# Altium project EDR Project.PrjPcb
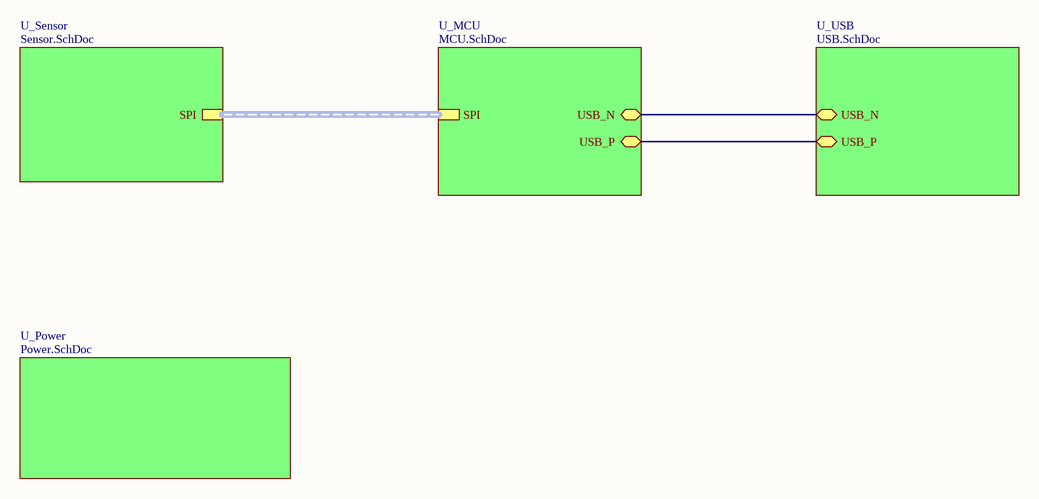
[diagram p0: Sheet2.SchDoc]
5 sheets, 58 parts. Net scope: hierarchical (ports join the sheet entries above them; power ports are global).
Board file: PCB1.PcbDoc
Sheets:
  Sheet2.SchDoc
    U_MCU = MCU.SchDoc
    U_Power = Power.SchDoc
    U_Sensor = Sensor.SchDoc
    U_USB = USB.SchDoc

## Sheet Sheet2.SchDoc
size A4; SheetNumber: 1; SheetTotal: 5

### Sub-sheets
U_MCU = MCU.SchDoc: SPI (harness SPI), USB_N (bidir), USB_P (bidir)
U_Power = Power.SchDoc: no entries
U_Sensor = Sensor.SchDoc: SPI (harness *)
U_USB = USB.SchDoc: USB_N (bidir), USB_P (bidir)

### Nets
USB_N: sheet U_MCU/USB_N, sheet U_USB/USB_N
USB_P: sheet U_MCU/USB_P, sheet U_USB/USB_P

### Buses and harness runs
harness sheet U_MCU/SPI = sheet U_Sensor/SPI

## Sheet MCU.SchDoc
size A4; SheetNumber: 2; SheetTotal: 5
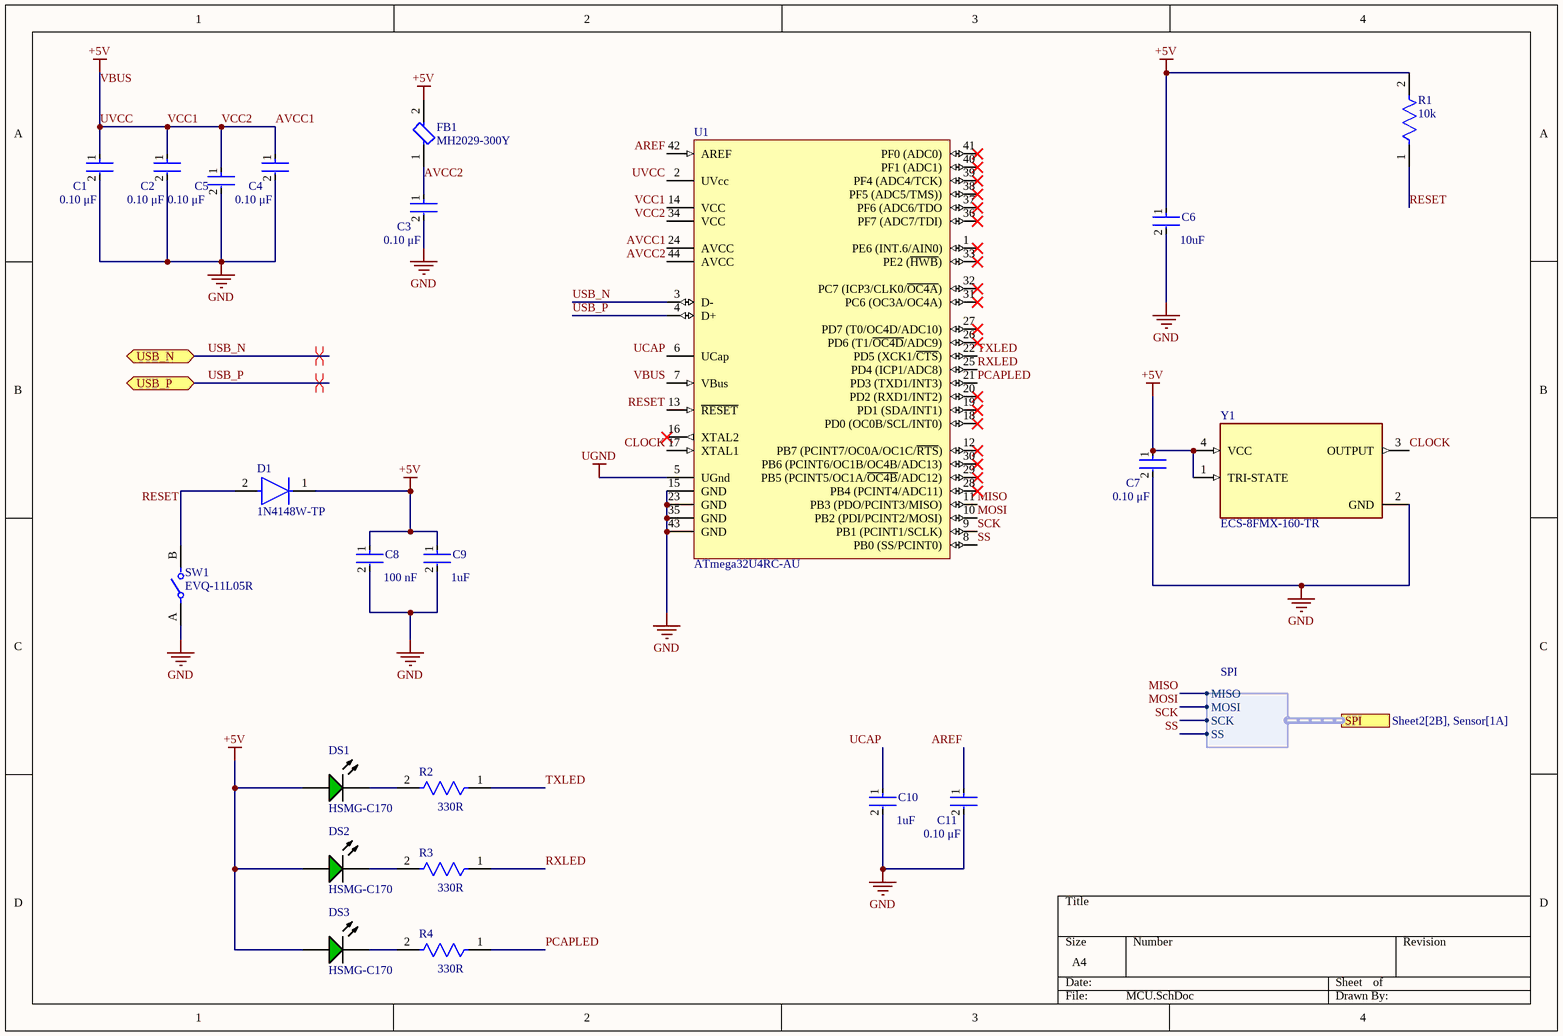
[diagram p1: MCU.SchDoc]

### Parts
C1  Capacitance: 0.10 μF  [FP-C0805C-DN-MFG]  (hidden comment: C0805C104J8RACTU)
C2  Capacitance: 0.10 μF  [FP-C0805C-DN-MFG]  (hidden comment: C0805C104J8RACTU)
C3  Capacitance: 0.10 μF  [FP-C0805C-DN-MFG]  (hidden comment: C0805C104J8RACTU)
C4  Capacitance: 0.10 μF  [FP-C0805C-DN-MFG]  (hidden comment: C0805C104J8RACTU)
C5  Capacitance: 0.10 μF  [FP-C0805C-DN-MFG]  (hidden comment: C0805C104J8RACTU)
C6  Capacitance: 10uF  [FP-C0805C-DG-MFG]  (hidden comment: C0805C106K8PACTU)
C7  Capacitance: 0.10 μF  [FP-C0805C-DN-MFG]  (hidden comment: C0805C104J8RACTU)
C8  Capacitance: 100 nF  [FP-CC0805-0_85-MFG]  (hidden comment: CC0805KRX7R7BB104)
C9  Capacitance: 1uF  [FP-C0805C-DG-MFG]  (hidden comment: C0805C106K8PACTU)
C10  Capacitance: 1uF  [FP-C0805C-DG-MFG]  (hidden comment: C0805C106K8PACTU)
C11  Capacitance: 0.10 μF  [FP-C0805C-DN-MFG]  (hidden comment: C0805C104J8RACTU)
D1  1N4148W-TP  [FP-SOD-123-IPC_A]
DS1  HSMG-C170  [AVAG-HSMX-C170_V]
DS2  HSMG-C170  [AVAG-HSMX-C170_V]
DS3  HSMG-C170  [AVAG-HSMX-C170_V]
FB1  MH2029-300Y  [FP-MH2029-MFG]
R1  Resistance: 10k  [FP-CRCW0805-e3-IPC_C]  (hidden comment: CRCW080522R0FKEA)
R2  Resistance: 330R  [FP-CR0805-IPC_B]  (hidden comment: 330 R)
R3  Resistance: 330R  [FP-CR0805-IPC_B]  (hidden comment: 330 R)
R4  Resistance: 330R  [FP-CR0805-IPC_B]  (hidden comment: 330 R)
SW1  EVQ-11L05R  [FP-EVQ-11L05R-MFG]
U1  ATmega32U4RC-AU  [44ML_N]
Y1  ECS-8FMX-160-TR  [OSC_ECS-8FMX-160-TR]

### Ports
SPI (harness SPI, see Sheet2[2B], Sensor[1A]), USB_N (bidir, see Sheet2[3B], USB[3B]), USB_P (bidir, see Sheet2[3B], USB[3B])

### Harnesses
SPI: MISO, MOSI, SCK, SS

### Nets
AVCC1: C1.1 C2.1 C4.1 C5.1 C6.1 C7.1 C8.1 C9.1 D1.1(C) DS1.1(A) DS2.1(A) DS3.1(A) FB1.2 R1.2 U1.2(UVcc) U1.7(VBus) U1.14(VCC) U1.24(AVCC) U1.34(VCC) Y1.1(TRI-STATE) Y1.4(VCC)  [also labelled +5V, UVCC, VBUS, VCC1, VCC2]
GND: C1.2 C2.2 C3.2 C4.2 C5.2 C6.2 C7.2 C8.2 C9.2 C10.2 C11.2 SW1.A U1.15(GND) U1.23(GND) U1.35(GND) U1.43(GND) Y1.2(GND)
UGND: U1.5(UGnd)
AREF: C11.1 U1.42(AREF)
AVCC2: C3.1 FB1.1 U1.44(AVCC)
CLOCK: U1.17(XTAL1) Y1.3(OUTPUT)
MISO: U1.11(PB3_(PDO/PCINT3/MISO)) ; port SPI.MISO
MOSI: U1.10(PB2_(PDI/PCINT2/MOSI)) ; port SPI.MOSI
PCAPLED: R4.1 U1.21(PD3_(TXD1/INT3))
RESET: D1.2(A) R1.1 SW1.B U1.13(~{RESET})
RXLED: R3.1 U1.25(PD4_(ICP1/ADC8))
SCK: U1.9(PB1_(PCINT1/SCLK)) ; port SPI.SCK
SS: U1.8(PB0_(SS/PCINT0)) ; port SPI.SS
TXLED: R2.1 U1.22(PD5_(XCK1/~{CTS}))
UCAP: C10.1 U1.6(UCap)
USB_N: U1.3(D-) ; port USB_N
USB_P: U1.4(D+) ; port USB_P
NetDS1_2: DS1.2(K) R2.2
NetDS2_2: DS2.2(K) R3.2
NetDS3_2: DS3.2(K) R4.2

Not connected (* = marked no-connect by the designer): U1 1(PE6_(INT.6/AIN0))* 12(PB7_(PCINT7/OC0A/OC1C/~{RTS}))* 16(XTAL2)* 18(PD0_(OC0B/SCL/INT0))* 19(PD1_(SDA/INT1))* 20(PD2_(RXD1/INT2))* 26(PD6_(T1/~{OC4D}/ADC9))* 27(PD7_(T0/OC4D/ADC10))* 28(PB4_(PCINT4/ADC11))* 29(PB5_(PCINT5/OC1A/~{OC4B}/ADC12))* 30(PB6_(PCINT6/OC1B/OC4B/ADC13))* 31(PC6_(OC3A/OC4A))* 32(PC7_(ICP3/CLK0/~{OC4A}))* 33(PE2_(~{HWB}))* 36(PF7_(ADC7/TDI))* 37(PF6_(ADC6/TDO)* 38(PF5_(ADC5/TMS)))* 39(PF4_(ADC4/TCK))* 40(PF1_(ADC1))* 41(PF0_(ADC0))*

### Layout directives
differential pair: USB_N, USB_P

### Library data of the parts
C1-C5 C7 C11 = CMP-03020-032188-1: CAP CER 0.1UF 10V 5% X7R 0805; Manufacturer: KEMET; Material: Ceramic; Tolerance: 0.05; Temperature Coefficient: 30ppm/°C; Value: 0.10 μF; Package: C0805C-DN; Device Class L1: Passive Components; Temperature: -55°C to +125°C; Category: Cap; RoHS: TRUE; Mouser Description: Multilayer Ceramic Capacitors MLCC - SMD/SMT 10volts 0.1uF X7R 5%; Lead Free: Yes; Temperature Range Low: -55°C; Temperature Range High: +125°C; Device Class L2: Capacitors; Temperature Characteristic: X7R; Device Class L3: Ceramic Capacitors; ComponentLink2Description: Datasheet; Automotive: No; Ipc Land Pattern Name: CAPC200125X78; Manufacturer Part Number: C0805C104J8RACTU; Voltage Rating: 10 V; Height: 0.88mm; Digikey Description: CAP CER 0.1UF 10V 5% X7R 0805; Octopart: https://octopart.com/c0805c104j8ractu-kemet-11807087; ComponentLink2URL: https://content.kemet.com/datasheets/KEM_C1003_C0G_SMD.pdf
C6 C9 C10 = CMP-2007-03243-2: CAP CER 10UF 10V X5R 0805; Manufacturer: Kemet; 3DS Part Number: 220-00001; Tolerance: 10%; Temperature Coefficient: 15%; Material: Ceramic; Device Class L2: Capacitors; Device Class L1: Passive Components; ComponentLink2URL: https://content.kemet.com/datasheets/KEM_C1006_X5R_SMD.pdf; Height: 1.4mm; Lead Free: Yes; Manufacturer Part Number: C0805C106K8PACTU; Digikey Description: CAP CER 10UF 10V X5R 0805; Octopart: https://octopart.com/c0805c106k8pactu-kemet-98697; Value: 10uF; Temperature Range Low: -55°C; Temperature: -55°C to +85°C; Automotive: No; Mouser Description: CAP CER 10UF 10V X5R 0805; Ipc Land Pattern Name: CAPC200125X125; Temperature Range High: +85°C; Voltage: 10V; RoHS: TRUE; Device Class L3: Ceramic Capacitors; ComponentLink2Description: Datasheet; Voltage Rating: 10V; Package: C0805C-DG; Temperature Characteristic: X5R; Category: Cap
C8 = CMP-1036-04402-6: CAP CER 0.1UF 16V X7R 0805; Manufacturer: Yageo; Material: Ceramic; Tolerance: 0.1; Value: 100 nF; Manufacturer Part Number: CC0805KRX7R7BB104; Temperature: -30°C to +85°C; Lead Free: Yes; Footprint Url: http://www.yageo.com/exep/pages/download/literatures/UPY-C_GEN_24.pdf; Voltage Rating: 16 V; Package: CC0805-0.85; RoHS: TRUE; Digikey Description: CAP CER 0.1UF 16V X7R 0805; Category: Cap; Octopart: https://octopart.com/cc0805krx7r7bb104-yageo-39467769; Device Class L3: Ceramic Capacitors; ComponentLink2URL: http://www.yageo.com/documents/recent/UPY-GPHC_Y5V_6.3V-to-50V_8.pdf; Temperature Range Low: -30°C; Mouser Description: Multilayer Ceramic Capacitors MLCC - SMD/SMT 100nF 16V X7R 10%; Automotive: No; Device Class L2: Capacitors; Height: 0.95mm; ComponentLink2Description: Datasheet; Temperature Characteristic: X7R; Ipc Land Pattern Name: CAPC200125X85; Device Class L1: Passive Components; Temperature Range High: +85°C
D1 = CMP-2000-04993-2: DIODE GEN PURP 100V 150MA SOD123; Max Reverse Leakage Current: 5uA; Max Surge Current: 2A; Reverse Recovery Time: 4ns; Polarity: Standard; Capacitance: 4pF; Max Forward Surge Current (Ifsm): 1A; Element Configuration: Single; Power Dissipation: 400mW; Forward Voltage: 1V; Radiation Hardening: No; Lead Free: Lead Free; Max Reverse Voltage (DC): 100V; Current Rating: 150mA; Forward Current: 150mA; Packaging: Tape and Reel; Number of Pins: 2; Package Quantity: 3000; Max Operating Temperature: 150°C; Min Operating Temperature: -65°C; Average Rectified Current: 150mA; Recovery Time: 4ns; Output Current: 150mA; Peak Non-Repetitive Surge Current: 2A; Width: 1.8mm; Voltage Rating (DC): 100V; Height: 1.2mm; Max Repetitive Reverse Voltage (Vrrm): 100V; Mount: Surface Mount; Length: 2.85mm
DS1-DS3 = CMP-2000-05062-1: Chip LED, Green, 2.2 V, -40 to 85 degC, 2-Pin SMD, Pb-Free, Tape and Reel; Manufacturer: Avago; No. of Pins: 2; Peak Wavelength: 570nm; SVHC: NoSVHC(16-Jun-2014); Dominant Wavelength: 572nm; Forward Current If: 20mA; Viewing Angle: 170deg; Lens Shape: Rectangular; PIV Max: 5V; External Width: 1.25mm; LED Type: Standard; External Depth: 0.8mm; Opto Mounting Orientation: Top; Luminous Intensity: 15mcd; Luminous Intensity Min: 4mcd; Forward Voltage VF Max: 2.6V; External Length / Height: 2mm; Bulb Size: 1.25mmx1.4mm; Light Area Height: 1mm; Voltage Vf Typ: 2.2V; Operating Temperature Max: 85degC; Datasheet Version: Oct-08; MSL: MSL2A-4weeks; Peak Forward Current: 20mA; Package Description: 2-Pin Surface Mount Device, Body 2 x 1.25 mm, Height 0.8 mm; Datasheet URL: https://datasheet.ciiva.com/29280/180495-da-01-en-chip-led-hsmg-c170-gelb-gruen-29280971.pdf; Storage Temperature Min: -40degC; LED Colour: Green; Wavelength Typ: 570nm; Mounting Type: SMD; Forward Current If Max: 20mA; Dominant Wavelength Typ: 572nm; LED Mounting: SMD; Operating Temperature Range: -30degCto+85degC; Operating Temperature Min: -30degC; Manufacturer URL: http://www.avagotech.com/; Packaging: CutTape; Luminous Intensity Typ: 15mcd; Package Reference: HSMX-C170; Storage Temperature Max: 85degC; Opto Case Style: SMD; Forward Voltage: 2.2V
FB1 = CMP-07252-000001-1: FERRITE BEAD 30 OHM 0805 1LN; Manufacturer: Bourns; Series Resistance: 25mΩ; Description: MH Series High Current Chip Ferrite Beads; Resistance: 30Ω; Value: 30Ω; Impedance At Frequency: 30Ω @ 100MHz; Rms Current: 3A; Tolerance: 25%; RoHS: TRUE; Manufacturer Part Number: MH2029-300Y; Temperature Range High: +125°C; Device Class L3: Ferrite Beads and Chips; Core Material: Ferrite; ComponentLink2Description: Datasheet; Category: FBead; Octopart: https://octopart.com/mh2029-300y-bourns-756929; Digikey Description: FERRITE BEAD 30 OHM 0805 1LN; Device Class L2: EMI / RFI Components; Lead Free: Yes; Mouser Description: Ferrite Beads 30 ohms 25% HIGH CURRENT; Automotive: No; Ipc Land Pattern Name: CAPC200120X90; Temperature: -55°C to +125°C; Device Class L1: Passive Components; Height: 1.1mm; ComponentLink2URL: https://www.bourns.com/docs/Product-Datasheets/mh.pdf; Package: MH2029; Temperature Range Low: -55°C
R1 = CMP-2001-03692-2: RES Thick Film, 22Ω, 1%, 0.125W, 100ppm/°C, 0805; Power Rating: 125mW; Voltage Rating: 150V; Case/Package: 0805; Radiation Hardening: No; Number of Terminations: 2; Termination: SMD/SMT; Package Quantity: 5000; Weight: 0.000194oz; Mount: Surface Mount; Lead Free: Lead Free; Height: 0.45mm; Composition: Thick Film; Min Operating Temperature: -55°C; Case Code (Metric): 2012; Temperature Coefficient: 100ppm/°C; Depth: 1.25mm; Packaging: Tape and Reel; Contact Plating: Tin; Width: 1.25mm; Case Code (Imperial): 0805; Length: 2mm; Max Operating Temperature: 155°C; Tolerance: 1%; Features: Automotive AEC-Q200; Military Standard: Not; Voltage Rating (DC): 150V; Max Power Dissipation: 125mW
R2-R4 = CMP-1013-00454-2: Thick Film Chip Resistors 0805 330Ω 0.125W 1% 100ppm/°C; Voltage Rating: 150V; Power Rating: 125mW; Case Code (Imperial): 0805; Packaging: Tape and Reel; REACH SVHC: No SVHC; Min Operating Temperature: -55°C; Height: 0.5mm; Tolerance: 1%; Radiation Hardening: No; Depth: 1.25mm; Mount: Surface Mount; Length: 2mm; Voltage Rating (DC): 150V; Contact Plating: Tin; Temperature Coefficient: 100ppm/°C; Thickness: 508um; Max Operating Temperature: 155°C; Termination: SMD/SMT; Military Standard: Not; Case Code (Metric): 2012; Width: 1.25mm; Package Quantity: 5000; Case/Package: 0805; Composition: Thick Film
SW1 = CMP-00287-55640044-1: EVQ-11L05R Switch Tactile N.O. SPST Round Button PC Pins 0.02A 15VDC 1.6N Thru-Hole Radial T/R; Max Current Rating: 20mA; Max Voltage Rating (DC): 15V; Mechanical Life: 100kcycles; Switch Function: Off-Mom; Switch Travel: 250µm; Number of Positions: 2; Actuator Length: 1.1mm; Illumination Type: Illuminated, Non-Illuminated; Contact Resistance: 50mΩ; Orientation: Straight; Max Operating Temperature: 70°C; Voltage Rating (DC): 15V; Length: 6mm; Electrical Life: 100kcycles; NexarPartId: 55640044; Termination: PC Pin; Height: 5mm; Radiation Hardening: No; Lead Free: Lead Free; Current Rating: 20mA; Mount: Through Hole; RoHS: Compliant; Operating Force: 1.6N; Contact Current Rating: 20mA; Throw Configuration: SPST; Life (Cycles): 100kcycles; REACH SVHC: Unknown; Min Operating Temperature: -20°C; Depth: 6mm; Case/Package: Radial
U1 = CMP-0095-00580-1: 8-bit AVR Microcontroller, 2.7-5.5V, 16MHz, 32KB Flash, 1KB EEPROM, 2.5KB SRAM, USB Controller, 44-pin TQFP, Industrial Grade (-40°C to 85°C), Int RC; PackageVersion: rev.G, Jul-2007; ComponentLink1URL: http://www.atmel.com/; ComponentLink2URL: http://www.atmel.com/dyn/resources/prod_documents/doc7766.pdf; PackageReference: 44ML; ComponentLink2Description: ATmega16U4/32U4 Datasheet; PackageDescription: 44-Pin Plastic Thin Quad Flat Pack, 10 x 10 x 1.0 mm Body, 0.8 mm Pitch (TQFP); ComponentLink3URL: http://www.atmel.com/dyn/resources/prod_documents/7766S.pdf; ComponentLink1Description: Manufacturer URL; DatasheetVersion: revF, Nov-2010; ComponentLink3Description: ATmega16U4 ATmega32U4 Summary
Y1 = CMP-009-000000-1: CMOS Oscillator Enable/Disable 4-SOJ, 5.08mm pitch; Component Type: Standard; Availability: Unavailable; Pin Count: 4; Price: None; Source: ECS-8FMX-160-TR.SchLib; Design Item ID: ECS-8FMX-160-TR; Value: *; MP: ECS-8FMX-160-TR; Package: None

## Sheet Power.SchDoc
size A4; SheetNumber: 4; SheetTotal: 5
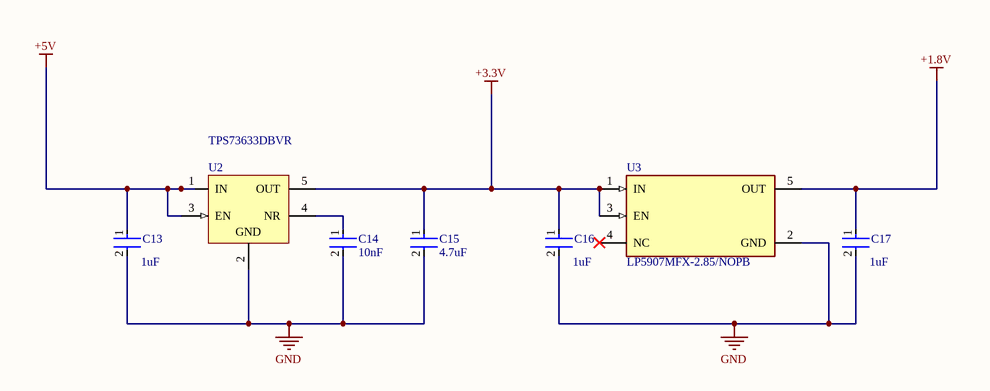
[diagram p2: Power.SchDoc]

### Parts
C13  Capacitance: 1uF  [FP-C0805C-DG-MFG]  (hidden comment: C0805C106K8PACTU)
C14  10nF  [FP-C0805C-DN-MFG]
C15  4.7uF  [FP-C0805C475K8PACTU-MFG]
C16  Capacitance: 1uF  [FP-C0805C-DG-MFG]  (hidden comment: C0805C106K8PACTU)
C17  Capacitance: 1uF  [FP-C0805C-DG-MFG]  (hidden comment: C0805C106K8PACTU)
U2  TPS73633DBVR  [DBV0005A_L]
U3  LP5907MFX-2.85/NOPB  [FP-DBV0005A-IPC_C]

### Nets
+1.8V: C17.1 U3.5(OUT)
+3.3V: C15.1 C16.1 U2.5(OUT) U3.1(IN) U3.3(EN)
+5V: C13.1 U2.1(IN) U2.3(EN)  [project net AVCC1]
GND: C13.2 C14.2 C15.2 C16.2 C17.2 U2.2(GND) U3.2(GND)
NetC14_1: C14.1 U2.4(NR)

Not connected (* = marked no-connect by the designer): U3 4(NC)*

### Library data of the parts
C13 C16 C17 = CMP-2007-03243-2: as C6 on sheet MCU; Device Class L2: Capacitors; Device Class L1: Passive Components; ComponentLink2URL: https://content.kemet.com/datasheets/KEM_C1006_X5R_SMD.pdf; Height: 1.4mm; Lead Free: Yes; Manufacturer Part Number: C0805C106K8PACTU; Digikey Description: CAP CER 10UF 10V X5R 0805; Octopart: https://octopart.com/c0805c106k8pactu-kemet-98697; Value: 10uF; Temperature Range Low: -55°C; Temperature: -55°C to +85°C; Automotive: No; Mouser Description: CAP CER 10UF 10V X5R 0805; Ipc Land Pattern Name: CAPC200125X125; Temperature Range High: +85°C; Voltage: 10V; RoHS: TRUE; Device Class L3: Ceramic Capacitors; ComponentLink2Description: Datasheet; Voltage Rating: 10V; Package: C0805C-DG; Temperature Characteristic: X5R; Category: Cap
C14 = CMP-2007-00493-2: CAP CER 10000PF 25V 5% NP0 0805; Manufacturer: KEMET; Manufacturer Part Number: C0805C103J3GACTU; Capacitance: 10,000 pF; Tolerance: 0.05; Value: 10,000 pF; Material: Ceramic; Temperature Characteristic: C0G; Temperature Coefficient: 30ppm/°C; Octopart: https://octopart.com/c0805c103j3gactu-kemet-12563663; Lead Free: Yes; RoHS: TRUE; Package: C0805C-DN; Voltage Rating: 25 V; Ipc Land Pattern Name: CAPC200125X78; ComponentLink2URL: https://content.kemet.com/datasheets/KEM_C1003_C0G_SMD.pdf; Device Class L1: Passive Components; Category: Cap; ComponentLink2Description: Datasheet; Temperature Range High: +125°C; Height: 0.88mm; Temperature Range Low: -55°C; Device Class L3: Ceramic Capacitors; Digikey Description: CAP CER 10000PF 25V 5% NP0 0805; Device Class L2: Capacitors; Mouser Description: Multilayer Ceramic Capacitors MLCC - SMD/SMT 25volts 10000pF 5% C0G; Temperature: -55°C to +125°C; Automotive: No
C15 = CMP-2007-01007-2: CAP CER 4.7UF 10V X5R 0805; Dielectric Material: Ceramic; Dissipation Factor: 5%; Tolerance: 10%; Lead Pitch: 0.75mm; Mount: Surface Mount; Voltage Rating (DC): 10V; Length: 2mm; Case Code (Imperial): 0805; Height: 1.25mm; Package Quantity: 1; Thickness: 0.055inch; Depth: 1.25mm; Case Code (Metric): 2012; Termination: SMD/SMT; Construction: Flat; Dielectric: X5R; Series: C; Capacitance: 4.7uF; Width: 1.2mm; Max Operating Temperature: 85°C; Packaging: Tape and Reel; Voltage Rating: 10V; REACH SVHC: No SVHC; Min Operating Temperature: -55°C; Number of Pins: 2; Case/Package: 0805; Radiation Hardening: No; Lead Free: Lead Free; Voltage: 10V; RoHS Compliant: Yes
U2 = CMP-0395-00256-2: Single Output Low Noise LDO, 400 mA, Fixed 3.3 V Output, 1.7 to 5.5 V Input, with Reverse Current Protection, 5-pin SOT-23 (DBV), -40 to 85 degC, Green (RoHS & no Sb/Br); Manufacturer: Texas Instruments; Vin(Min)(V): 1.7; Vdo(Typ)(mV): 75; Iq(Typ)(mA): 0.3; SubFamily: Single Channel LDO; Vout Adj(Max)(V): 3.3; Accuracy(%): 1; Vin(Max)(V): 5.5; Iout(Max)(A): 0.4; Rating: Catalog; ComponentLink1Description: Manufacturer URL; PartNumber: TPS73633DBVR; PackageDescription: 5-Pin Plastic Small Outline, Body 1.60 Ãƒâ€” 2.90 mm, Pitch 0.95 mm; ComponentLink3URL: http://www.ti.com/litv/pdf/mpds018i; ComponentLink2Description: Datasheet; ComponentLink4Description: URL Link1; DatasheetVersion: SBVS038T; Vout Adj(Min)(V): 3.3; Code_JEDEC: MO-178; Fixed Output Options(V): 3.3; Eco-Plan: Green (RoHS & no Sb/Br); PackageReference: DBV0005A; ComponentLink4URL: Samples URL:http://www.ti.com/product/tps73633#samples; PackageVersion: 4073253-4/K; ComponentLink2URL: http://www.ti.com/general/docs/lit/getliterature.tsp?genericPartNumber=TPS73633&fileType=pdf; ComponentLink1URL: http://www.ti.com/; ComponentLink3Description: Package Specification; Mounting Technology: Surface Mount
U3 = CMP-04917-000259-2: IC REG LIN 2.85V 250MA SOT23-5; Number of Outputs: 1; Min Input Voltage: 2.2V; Output Type: Fixed; Power Supply Rejection Ratio (PSRR): 82dB; Max Input Voltage: 5.5V; Quiescent Current: 12uA; Dropout Voltage: 250mV; Output Current: 250mA; Packaging: Tape and Reel; Max Operating Temperature: 125°C; Min Operating Temperature: -40°C; RoHS Compliant: Yes; Package Quantity: 3000; Lead Free: Lead Free; Output Voltage: 2.85V; Case/Package: SOT-23-5

## Sheet Sensor.SchDoc
size A4; SheetNumber: 5; SheetTotal: 5
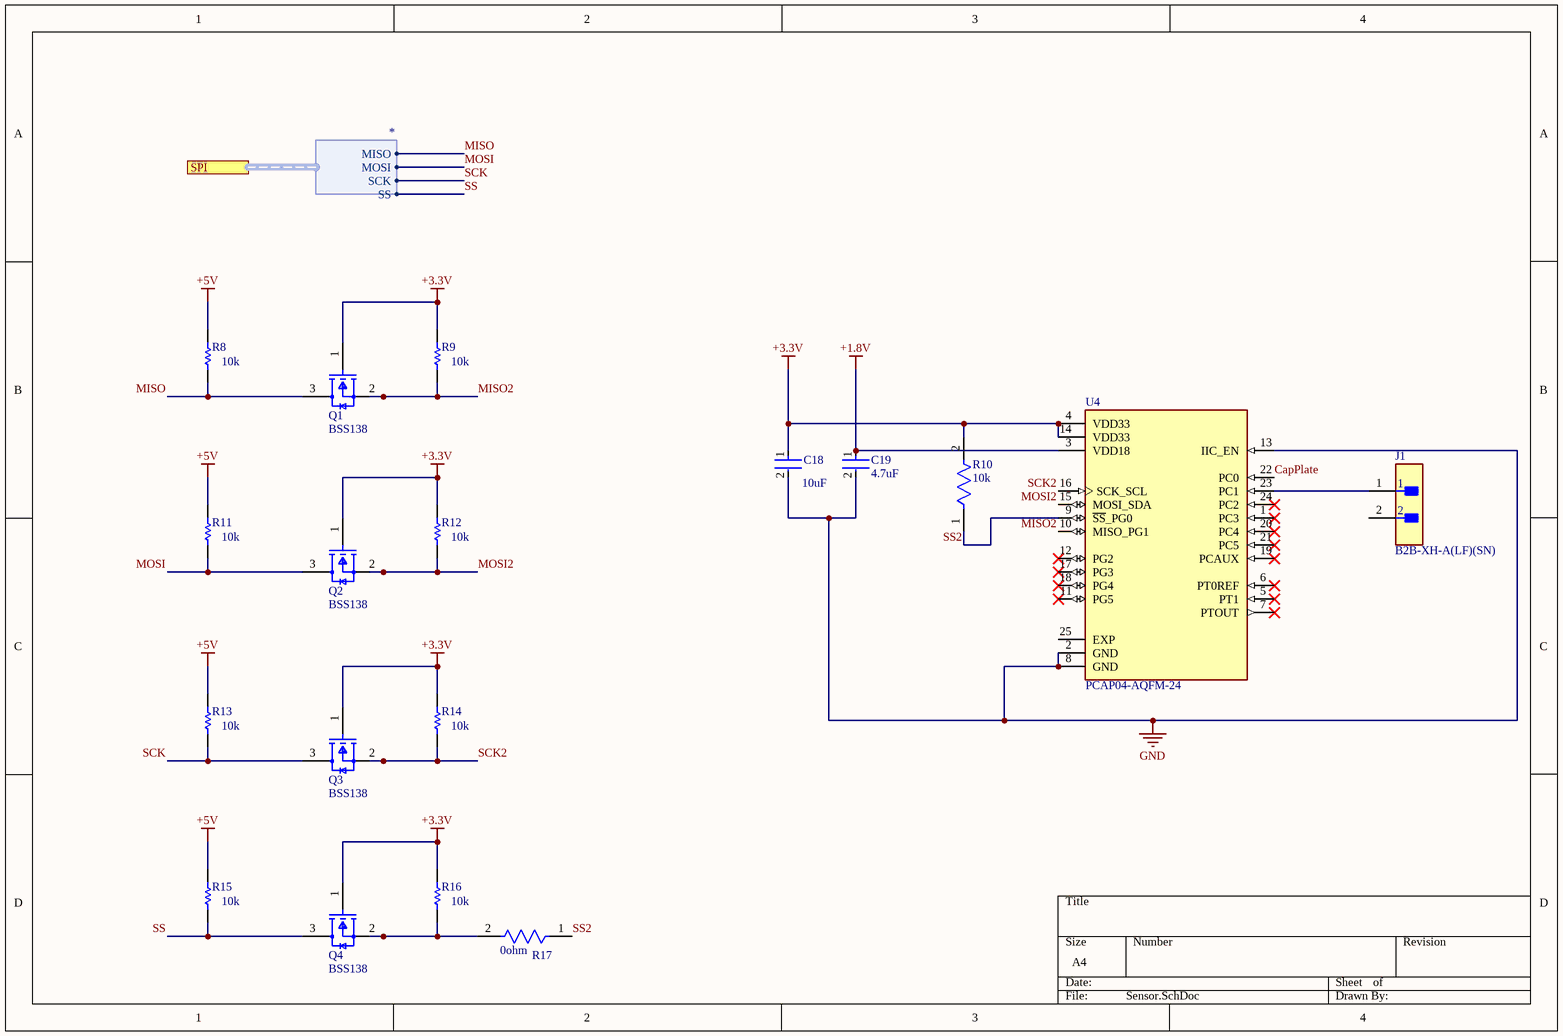
[diagram p3: Sensor.SchDoc]

### Parts
C18  Capacitance: 10uF  [FP-C0805C-DG-MFG]  (hidden comment: C0805C106K8PACTU)
C19  4.7uF  [FP-C0805C475K8PACTU-MFG]
J1  B2B-XH-A(LF)(SN)  [FP-B2B-XH-A_LF_SN-MFG]
Q1  BSS138  [FP-318-08-IPC_B]
Q2  BSS138  [FP-318-08-IPC_B]
Q3  BSS138  [FP-318-08-IPC_B]
Q4  BSS138  [FP-318-08-IPC_B]
R8  10k  [RESC3116X65X50NL20T20]
R9  10k  [RESC3116X65X50NL20T20]
R10  Resistance: 10k  [FP-CRCW0805-e3-IPC_C]  (hidden comment: CRCW080522R0FKEA)
R11  10k  [RESC3116X65X50NL20T20]
R12  10k  [RESC3116X65X50NL20T20]
R13  10k  [RESC3116X65X50NL20T20]
R14  10k  [RESC3116X65X50NL20T20]
R15  10k  [RESC3116X65X50NL20T20]
R16  10k  [RESC3116X65X50NL20T20]
R17  Resistance: 0ohm  [FP-CRCW0805-e3-IPC_C]  (hidden comment: CRCW080522R0FKEA)
U4  PCAP04-AQFM-24  [IC_PCAP04-AQFM-24]

### Ports
SPI (harness *, see Sheet2[2B], MCU[4C])

### Harnesses
*: MISO, MOSI, SCK, SS

### Nets
+1.8V: C19.1 U4.3(VDD18)
+3.3V: C18.1 Q1.1(G) Q2.1(G) Q3.1(G) Q4.1(G) R9.2 R10.2 R12.2 R14.2 R16.2 U4.4(VDD33) U4.14(VDD33)
+5V: R8.2 R11.2 R13.2 R15.2  [project net AVCC1]
GND: C18.2 C19.2 U4.2(GND) U4.8(GND) U4.13(IIC_EN)
CapPlate: U4.22(PC0)
MISO: Q1.3(D) R8.1 ; port SPI.MISO
MISO2: Q1.2(S) R9.1 U4.10(MISO_PG1)
MOSI: Q2.3(D) R11.1 ; port SPI.MOSI
MOSI2: Q2.2(S) R12.1 U4.15(MOSI_SDA)
SCK: Q3.3(D) R13.1 ; port SPI.SCK
SCK2: Q3.2(S) R14.1 U4.16(SCK_SCL)
SS: Q4.3(D) R15.1 ; port SPI.SS
SS2: R10.1 R17.1 U4.9(~{SS}_PG0)
NetJ1_1: J1.1 U4.23(PC1)
NetQ4_2: Q4.2(S) R16.1 R17.2

Not connected (* = marked no-connect by the designer): J1 2; U4 1(PC3)* 5(PT1)* 6(PT0REF)* 7(PTOUT)* 11(PG5)* 12(PG2)* 17(PG3)* 18(PG4)* 19(PCAUX)* 20(PC4)* 21(PC5)* 24(PC2)* 25(EXP)

### Library data of the parts
C18 = CMP-2007-03243-2: as C6 on sheet MCU; Device Class L2: Capacitors; Device Class L1: Passive Components; ComponentLink2URL: https://content.kemet.com/datasheets/KEM_C1006_X5R_SMD.pdf; Height: 1.4mm; Lead Free: Yes; Manufacturer Part Number: C0805C106K8PACTU; Digikey Description: CAP CER 10UF 10V X5R 0805; Octopart: https://octopart.com/c0805c106k8pactu-kemet-98697; Value: 10uF; Temperature Range Low: -55°C; Temperature: -55°C to +85°C; Automotive: No; Mouser Description: CAP CER 10UF 10V X5R 0805; Ipc Land Pattern Name: CAPC200125X125; Temperature Range High: +85°C; Voltage: 10V; RoHS: TRUE; Device Class L3: Ceramic Capacitors; ComponentLink2Description: Datasheet; Voltage Rating: 10V; Package: C0805C-DG; Temperature Characteristic: X5R; Category: Cap
C19 = CMP-2007-01007-2: as C15 on sheet Power; Lead Pitch: 0.75mm; Mount: Surface Mount; Voltage Rating (DC): 10V; Length: 2mm; Case Code (Imperial): 0805; Height: 1.25mm; Package Quantity: 1; Thickness: 0.055inch; Depth: 1.25mm; Case Code (Metric): 2012; Termination: SMD/SMT; Construction: Flat; Dielectric: X5R; Series: C; Capacitance: 4.7uF; Width: 1.2mm; Max Operating Temperature: 85°C; Packaging: Tape and Reel; Voltage Rating: 10V; REACH SVHC: No SVHC; Min Operating Temperature: -55°C; Number of Pins: 2; Case/Package: 0805; Radiation Hardening: No; Lead Free: Lead Free; Voltage: 10V; RoHS Compliant: Yes
J1 = CMP-2000-05888-3: CONN HEADER VERT 2POS 2.5MM; Current Rating: 3A; Voltage Rating: 250V; Number of Contacts: 2; Contact Resistance: 20mR; Wire/Cable Gauge: 22AWG; Insulation Resistance: 1GR; Connector Type: Male Pin; Packaging: Bulk; Contact Material: Brass; Lead Free: Lead Free; Orientation: Straight; Contact Plating: Tin; Max Current Rating: 3A; Termination: Solder; Fastening Type: Detent; Depth: 5.75mm; Housing Material: Polyamide; REACH SVHC: No SVHC; Series: XH; Voltage Rating (AC): 250V; Number of Positions: 2; Color: Natural; Contact Type: Male Pin; Max Voltage Rating (DC): 250V; Pitch: 2.5mm; Lead Pitch: 2.5mm; Mount: Through Hole; Max Operating Temperature: 85°C; Length: 7.4mm; Max Voltage Rating (AC): 250V; Min Operating Temperature: -25°C; Number of Rows: 1; Housing Color: White
Q1-Q4 = CMP-07173-000101-1: MOSFET N-CH 50V 220MA SOT-23; Turn-Off Delay Time: 20ns; Element Configuration: Single; Rds On Max: 3.5R; Gate to Source Voltage (Vgs): 20V; Threshold Voltage: 1.3V; Number of Elements: 1; Power Dissipation: 360mW; Rise Time: 9ns; Turn-On Delay Time: 2.5ns; Input Capacitance: 27pF; On-State Resistance: 6R; Lead Free: Lead Free; Length: 2.92mm; Width: 1.3mm; Drain to Source Breakdown Voltage: 50V; Min Operating Temperature: -55°C; REACH SVHC: No SVHC; Packaging: Tape and Reel; Radiation Hardening: No; Height: 0.93mm; Drain to Source Voltage (Vdss): 50V; Current Rating: 220mA; Voltage Rating (DC): 50V; Weight: 0.03g; Continuous Drain Current (ID): 220mA; Number of Pins: 3; Nominal Vgs: 1.3V; Max Power Dissipation: 360mW; Fall Time: 9ns; Drain to Source Resistance: 3.5R; Contact Plating: Tin; Case/Package: SOT-23; Package Quantity: 1; Dual Supply Voltage: 50V; Mount: Surface Mount; Termination: SMD/SMT; Max Operating Temperature: 150°C
R8 R9 R11-R16 = CMP-2003-04883-1: Part Number: CRCW120610K0FKEAHP; Manufacturer: Vishay Dale
R10 R17 = CMP-2001-03692-2: as R1 on sheet MCU; Case/Package: 0805; Radiation Hardening: No; Number of Terminations: 2; Termination: SMD/SMT; Package Quantity: 5000; Weight: 0.000194oz; Mount: Surface Mount; Lead Free: Lead Free; Height: 0.45mm; Composition: Thick Film; Min Operating Temperature: -55°C; Case Code (Metric): 2012; Temperature Coefficient: 100ppm/°C; Depth: 1.25mm; Packaging: Tape and Reel; Contact Plating: Tin; Width: 1.25mm; Case Code (Imperial): 0805; Length: 2mm; Max Operating Temperature: 155°C; Tolerance: 1%; Features: Automotive AEC-Q200; Military Standard: Not; Voltage Rating (DC): 150V; Max Power Dissipation: 125mW
U4 = CMP-007-000000-1: Capacitance-to-Digital Converter 17 b IÂ²C, SPI 24-QFN (4x4); MF: ScioSense; Value: *; Pin Count: 25; Package: QFN-24 ScioSense; Component Type: Standard; MP: PCAP04-AQFM-24; Design Item ID: PCAP04-AQFM-24; Source: PCAP04-AQFM-24.SchLib; Check_prices: https://www.snapeda.com/parts/PCAP04-AQFM-24/ScioSense/view-part/?ref=eda; SnapEDA_Link: https://www.snapeda.com/parts/PCAP04-AQFM-24/ScioSense/view-part/?ref=snap

## Sheet USB.SchDoc
size A4; SheetNumber: 3; SheetTotal: 5
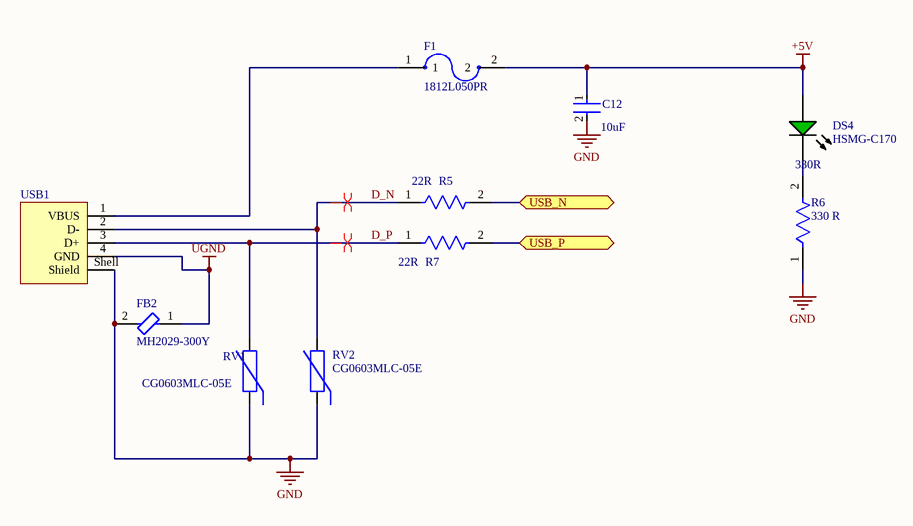
[diagram p4: USB.SchDoc]

### Parts
C12  Capacitance: 10uF  [FP-C0805C-DG-MFG]  (hidden comment: C0805C106K8PACTU)
DS4  HSMG-C170  [AVAG-HSMX-C170_V]
F1  1812L050PR  [FUSM4632X75]
FB2  MH2029-300Y  [FP-MH2029-MFG]
R5  Resistance: 22R  [FP-CRCW0805-e3-IPC_C]  (hidden comment: CRCW080522R0FKEA)
R6  330 R  Resistance: 330R  [FP-CR0805-IPC_B]
R7  Resistance: 22R  [FP-CRCW0805-e3-IPC_C]  (hidden comment: CRCW080522R0FKEA)
RV1  CG0603MLC-05E  [BOUR-CG0603-2_V]
RV2  CG0603MLC-05E  [BOUR-CG0603-2_V]
USB1  61400416021  [61400416021]  (value not drawn)

### Ports
USB_N (bidir, see Sheet2[3B], MCU[1B]), USB_P (bidir, see Sheet2[3B], MCU[1B])

### Nets
+5V: C12.1 DS4.1(A) F1.2  [project net AVCC1]
GND: C12.2 FB2.2 R6.1 RV1.1 RV2.1 USB1.Shell(Shield)
UGND: FB2.1 USB1.4(GND)
D_N: R5.1 RV2.2 USB1.2(D-)
D_P: R7.1 RV1.2 USB1.3(D+)
USB_N: R5.2 ; port USB_N
USB_P: R7.2 ; port USB_P
NetDS4_2: DS4.2(K) R6.2
NetF1_1: F1.1 USB1.1(VBUS)

### Layout directives
differential pair: D_N, D_P

### Library data of the parts
C12 = CMP-2007-03243-2: as C6 on sheet MCU; Device Class L2: Capacitors; Device Class L1: Passive Components; ComponentLink2URL: https://content.kemet.com/datasheets/KEM_C1006_X5R_SMD.pdf; Height: 1.4mm; Lead Free: Yes; Manufacturer Part Number: C0805C106K8PACTU; Digikey Description: CAP CER 10UF 10V X5R 0805; Octopart: https://octopart.com/c0805c106k8pactu-kemet-98697; Value: 10uF; Temperature Range Low: -55°C; Temperature: -55°C to +85°C; Automotive: No; Mouser Description: CAP CER 10UF 10V X5R 0805; Ipc Land Pattern Name: CAPC200125X125; Temperature Range High: +85°C; Voltage: 10V; RoHS: TRUE; Device Class L3: Ceramic Capacitors; ComponentLink2Description: Datasheet; Voltage Rating: 10V; Package: C0805C-DG; Temperature Characteristic: X5R; Category: Cap
DS4 = CMP-2000-05062-1: as DS1 on sheet MCU; Operating Temperature Max: 85degC; Datasheet Version: Oct-08; MSL: MSL2A-4weeks; Peak Forward Current: 20mA; Package Description: 2-Pin Surface Mount Device, Body 2 x 1.25 mm, Height 0.8 mm; Datasheet URL: https://datasheet.ciiva.com/29280/180495-da-01-en-chip-led-hsmg-c170-gelb-gruen-29280971.pdf; Storage Temperature Min: -40degC; LED Colour: Green; Wavelength Typ: 570nm; Mounting Type: SMD; Forward Current If Max: 20mA; Dominant Wavelength Typ: 572nm; LED Mounting: SMD; Operating Temperature Range: -30degCto+85degC; Operating Temperature Min: -30degC; Manufacturer URL: http://www.avagotech.com/; Packaging: CutTape; Luminous Intensity Typ: 15mcd; Package Reference: HSMX-C170; Storage Temperature Max: 85degC; Opto Case Style: SMD; Forward Voltage: 2.2V
F1 = CMP-005-00013-1: Polymeric PTC Resettable Fuse 15V 500mA Ih Surface Mount 1812 (4532 Metric), Concave; MF: Littelfuse Inc.; Source: 1812L050PR.SchLib; Purchase-URL: https://pricing.snapeda.com/search/part/1812L050PR/?ref=eda; SnapEDA_Link: https://www.snapeda.com/parts/1812L050PR/Littelfuse%20Inc./view-part/46902/?ref=snap; Value: *; Availability: Good; Component Type: Standard; Check_prices: https://www.snapeda.com/parts/1812L050PR/Littelfuse%20Inc./view-part/46902/?ref=eda; MP: 1812L050PR; Price: None; Pins: 2; Design Item ID: 1812L050PR; Case/Package: 1812 Littelfuse Inc.
FB2 = CMP-07252-000001-1: as FB1 on sheet MCU; RoHS: TRUE; Manufacturer Part Number: MH2029-300Y; Temperature Range High: +125°C; Device Class L3: Ferrite Beads and Chips; Core Material: Ferrite; ComponentLink2Description: Datasheet; Category: FBead; Octopart: https://octopart.com/mh2029-300y-bourns-756929; Digikey Description: FERRITE BEAD 30 OHM 0805 1LN; Device Class L2: EMI / RFI Components; Lead Free: Yes; Mouser Description: Ferrite Beads 30 ohms 25% HIGH CURRENT; Automotive: No; Ipc Land Pattern Name: CAPC200120X90; Temperature: -55°C to +125°C; Device Class L1: Passive Components; Height: 1.1mm; ComponentLink2URL: https://www.bourns.com/docs/Product-Datasheets/mh.pdf; Package: MH2029; Temperature Range Low: -55°C
R5 R7 = CMP-2001-03692-2: as R1 on sheet MCU; Case/Package: 0805; Radiation Hardening: No; Number of Terminations: 2; Termination: SMD/SMT; Package Quantity: 5000; Weight: 0.000194oz; Mount: Surface Mount; Lead Free: Lead Free; Height: 0.45mm; Composition: Thick Film; Min Operating Temperature: -55°C; Case Code (Metric): 2012; Temperature Coefficient: 100ppm/°C; Depth: 1.25mm; Packaging: Tape and Reel; Contact Plating: Tin; Width: 1.25mm; Case Code (Imperial): 0805; Length: 2mm; Max Operating Temperature: 155°C; Tolerance: 1%; Features: Automotive AEC-Q200; Military Standard: Not; Voltage Rating (DC): 150V; Max Power Dissipation: 125mW
R6 = CMP-1013-00454-2: as R2 on sheet MCU; Case Code (Imperial): 0805; Packaging: Tape and Reel; REACH SVHC: No SVHC; Min Operating Temperature: -55°C; Height: 0.5mm; Tolerance: 1%; Radiation Hardening: No; Depth: 1.25mm; Mount: Surface Mount; Length: 2mm; Voltage Rating (DC): 150V; Contact Plating: Tin; Temperature Coefficient: 100ppm/°C; Thickness: 508um; Max Operating Temperature: 155°C; Termination: SMD/SMT; Military Standard: Not; Case Code (Metric): 2012; Width: 1.25mm; Package Quantity: 5000; Case/Package: 0805; Composition: Thick Film
RV1 RV2 = CMP-0584-00001-2: ESD Protector, 5 V Supply, -40 to 85 degC, 1.6 x 0.8 x 0.55 mm SMD, RoHS, Tape and Reel; Manufacturer: Bourns; VC: 20 V; VT: 150 V; RT: 1 ns; VDC: 5 V; CO: 0.5 pF; PartNumber: CG0603MLC-05E; ComponentLink1Description: Manufacturer URL; ComponentLink1URL: http://www.bourns.com/; Packing: Tape and Reel; Mounting Technology: Surface Mount; ComponentLink2Description: Datasheet; RoHS: TRUE; Operating Temperature: -40 to 85 degC; DatasheetVersion: Rev. S; PackageDescription: 2-Pin SMD, Body 1.6 x 0.8 mm, Pitch 1.52 mm; PackageReference: CG0603-2; ComponentLink2URL: http://www.bourns.com/data/global/pdfs/MLC.pdf
USB1 = CMP-1502-03227-2: NexarPartId: 21041530; Contact Resistance: 20mΩ; Gender: Receptacle; Voltage Rating (DC): 30V; Current Rating: 1.5A; Connector Type: USB; Insulation Resistance: 1GΩ; USB Standard: USB 2.0; Number of Contacts: 4; Number of Ports: 1; Width: 14.4mm; REACH SVHC: Unknown; Contact Plating: Gold; Length: 15.8mm; Lead Free: Lead Free; Max Operating Temperature: 105°C; Orientation: Horizontal; Contact Material: Copper; Voltage Rating: 30V; Min Operating Temperature: -40°C; Flammability Rating: UL94 V-0; Color: White; RoHS: Compliant; Number of Pins: 4; Mount: Horizontal, Through Hole; Number of Positions: 4; Operating Supply Voltage: 30V; Insulation Material: PBT; Termination: Solder

## Nets that join several sheets
+1.8V: Power (C17.1 U3.5), Sensor (C19.1 U4.3)
+3.3V: Power (5 pins), Sensor (12 pins)
AVCC1: MCU (21 pins), Power (C13.1 U2.1 U2.3), Sensor (R8.2 R11.2 R13.2 R15.2), USB (C12.1 DS4.1 F1.2)
GND: MCU (17 pins), Power (7 pins), Sensor (5 pins), USB (6 pins)
UGND: MCU (U1.5), USB (FB2.1 USB1.4)
MISO: MCU (U1.11), Sensor (Q1.3 R8.1)
MOSI: MCU (U1.10), Sensor (Q2.3 R11.1)
SCK: MCU (U1.9), Sensor (Q3.3 R13.1)
SS: MCU (U1.8), Sensor (Q4.3 R15.1)
USB_N: MCU (U1.3), USB (R5.2)
USB_P: MCU (U1.4), USB (R7.2)